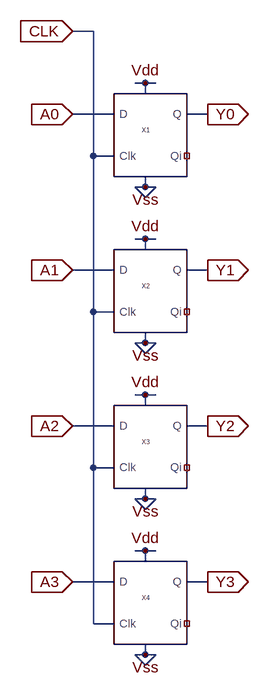
[diagram p0: schematic 4bitreg.asc]
4bitreg.asc, the LTspice schematic file:
Version 4
SHEET 1 880 1012
WIRE -192 -224 -224 -224
WIRE -112 -144 -128 -144
WIRE -96 -144 -112 -144
WIRE -112 -128 -112 -144
WIRE -160 -96 -224 -96
WIRE -16 -96 -48 -96
WIRE -192 -32 -192 -224
WIRE -160 -32 -192 -32
WIRE -112 16 -112 0
WIRE -112 16 -128 16
WIRE -96 16 -112 16
WIRE -112 32 -128 16
WIRE -112 32 -96 16
WIRE -112 96 -128 96
WIRE -96 96 -112 96
WIRE -112 112 -112 96
WIRE -160 144 -224 144
WIRE -16 144 -48 144
WIRE -192 208 -192 -32
WIRE -160 208 -192 208
WIRE -112 256 -112 240
WIRE -112 256 -128 256
WIRE -96 256 -112 256
WIRE -112 272 -128 256
WIRE -112 272 -96 256
WIRE -112 336 -128 336
WIRE -96 336 -112 336
WIRE -112 352 -112 336
WIRE -160 384 -224 384
WIRE -16 384 -48 384
WIRE -192 448 -192 208
WIRE -160 448 -192 448
WIRE -112 496 -112 480
WIRE -112 496 -128 496
WIRE -96 496 -112 496
WIRE -112 512 -128 496
WIRE -112 512 -96 496
WIRE -112 576 -128 576
WIRE -96 576 -112 576
WIRE -112 592 -112 576
WIRE -160 624 -224 624
WIRE -16 624 -48 624
WIRE -192 688 -192 448
WIRE -160 688 -192 688
WIRE -112 736 -112 720
WIRE -112 736 -128 736
WIRE -96 736 -112 736
WIRE -112 752 -128 736
WIRE -112 752 -96 736
FLAG -112 -144 Vdd
FLAG -112 16 Vss
FLAG -224 -96 A0
IOPIN -224 -96 In
FLAG -16 -96 Y0
IOPIN -16 -96 Out
FLAG -112 96 Vdd
FLAG -112 256 Vss
FLAG -224 144 A1
IOPIN -224 144 In
FLAG -16 144 Y1
IOPIN -16 144 Out
FLAG -112 336 Vdd
FLAG -112 496 Vss
FLAG -224 384 A2
IOPIN -224 384 In
FLAG -16 384 Y2
IOPIN -16 384 Out
FLAG -112 576 Vdd
FLAG -112 736 Vss
FLAG -224 624 A3
IOPIN -224 624 In
FLAG -16 624 Y3
IOPIN -16 624 Out
FLAG -224 -224 CLK
IOPIN -224 -224 In
SYMBOL dff -160 0 R0
SYMATTR InstName X1
SYMBOL dff -160 240 R0
SYMATTR InstName X2
SYMBOL dff -160 480 R0
SYMATTR InstName X3
SYMBOL dff -160 720 R0
SYMATTR InstName X4

The netlist it stands for:
* 4bitreg.asc
XX1 A0 CLK Y0 NC_01 Vdd Vss dff  ; pins D Clk Q Qi VDD Vss
XX2 A1 CLK Y1 NC_02 Vdd Vss dff  ; pins D Clk Q Qi VDD Vss
XX3 A2 CLK Y2 NC_03 Vdd Vss dff  ; pins D Clk Q Qi VDD Vss
XX4 A3 CLK Y3 NC_04 Vdd Vss dff  ; pins D Clk Q Qi VDD Vss
.backanno
.end